# EAGLE schematic Maduino Zero 4G LTE v1.2 (EAGLE 6.1)
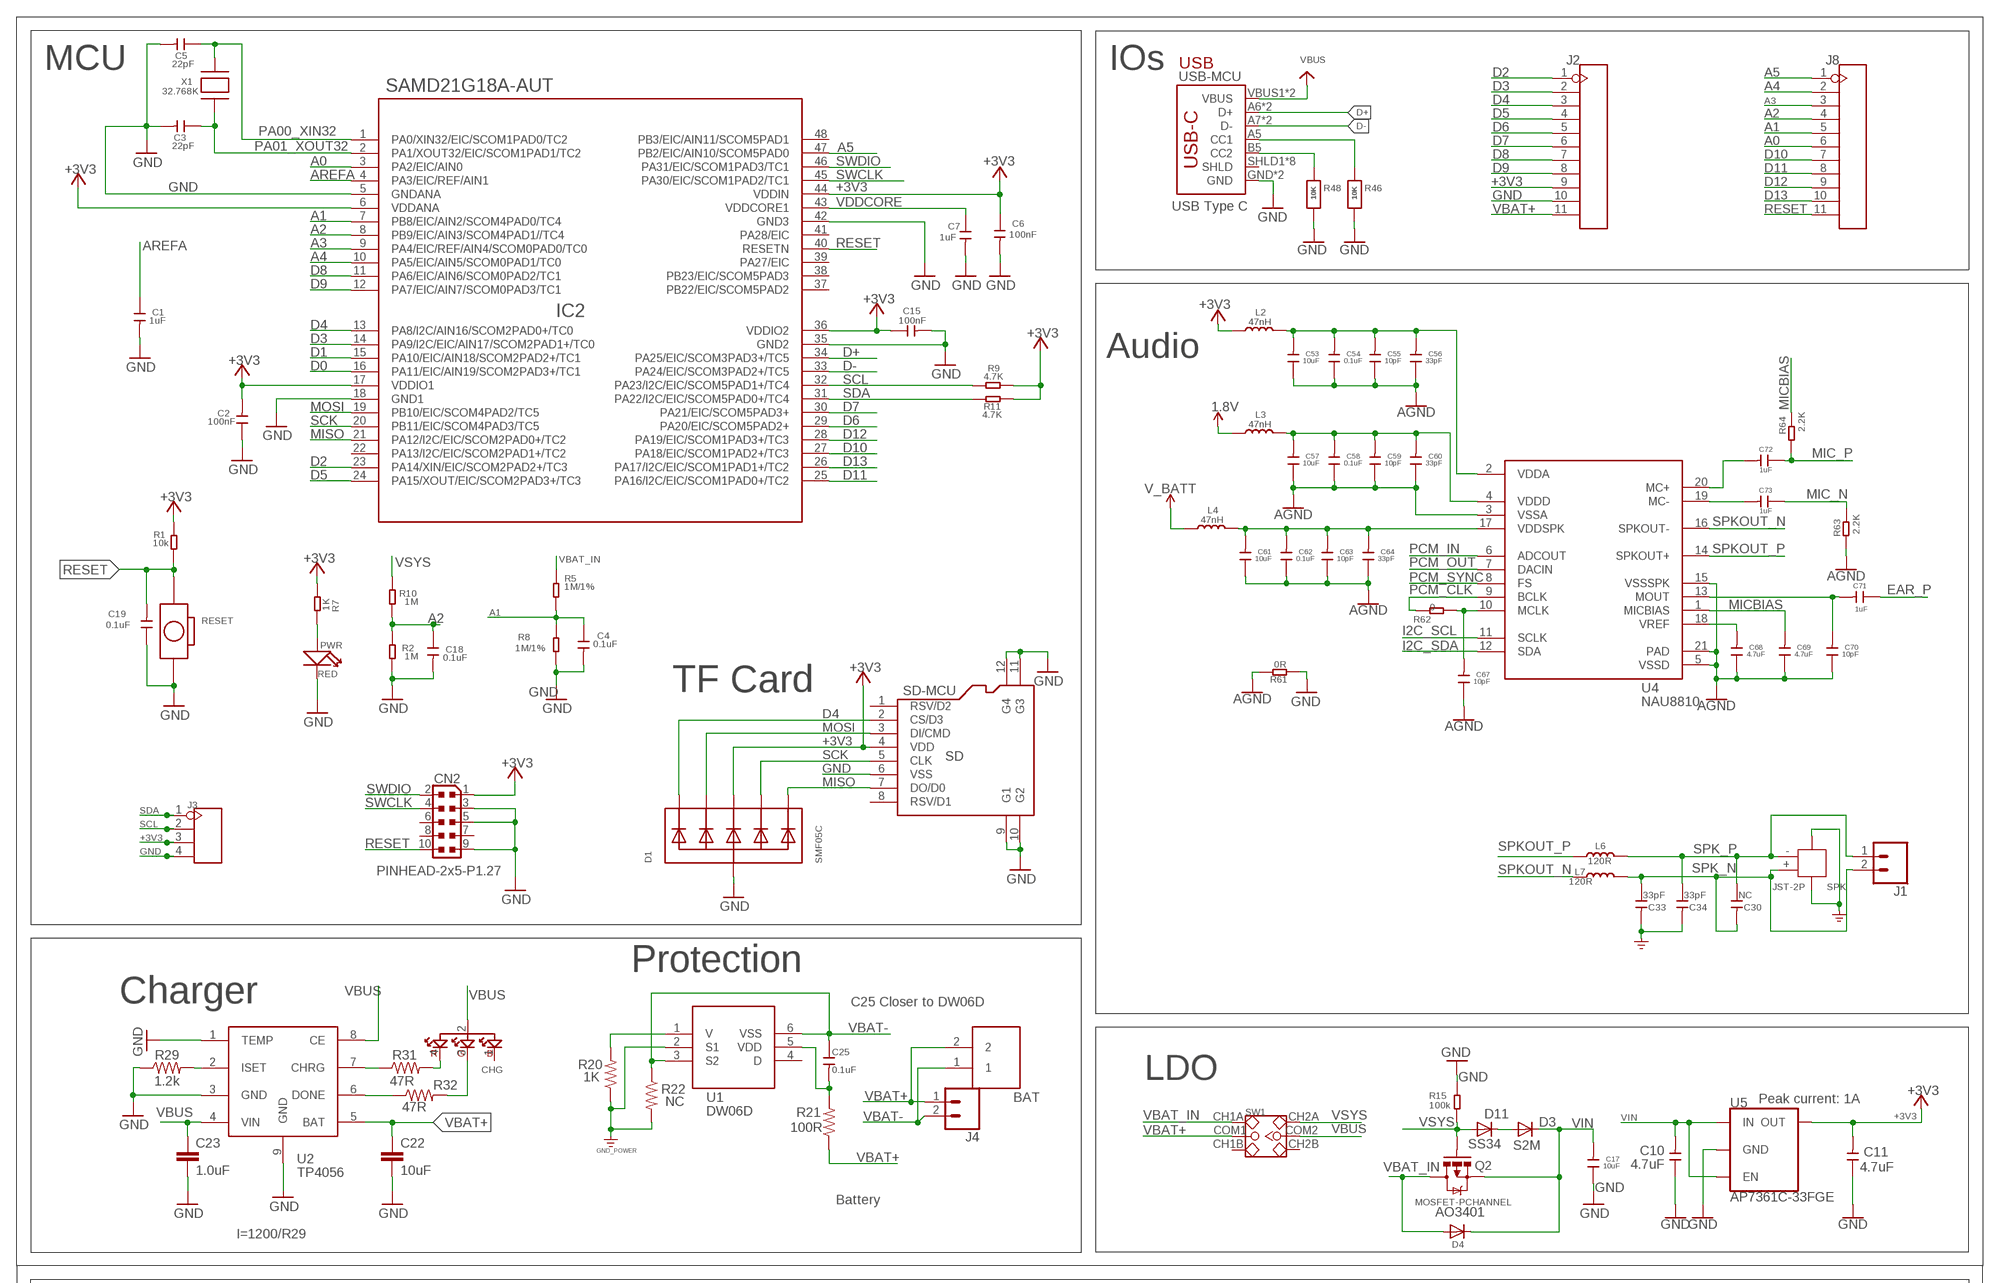
[diagram p0: schematic, sheet 1, part 1 of 2]
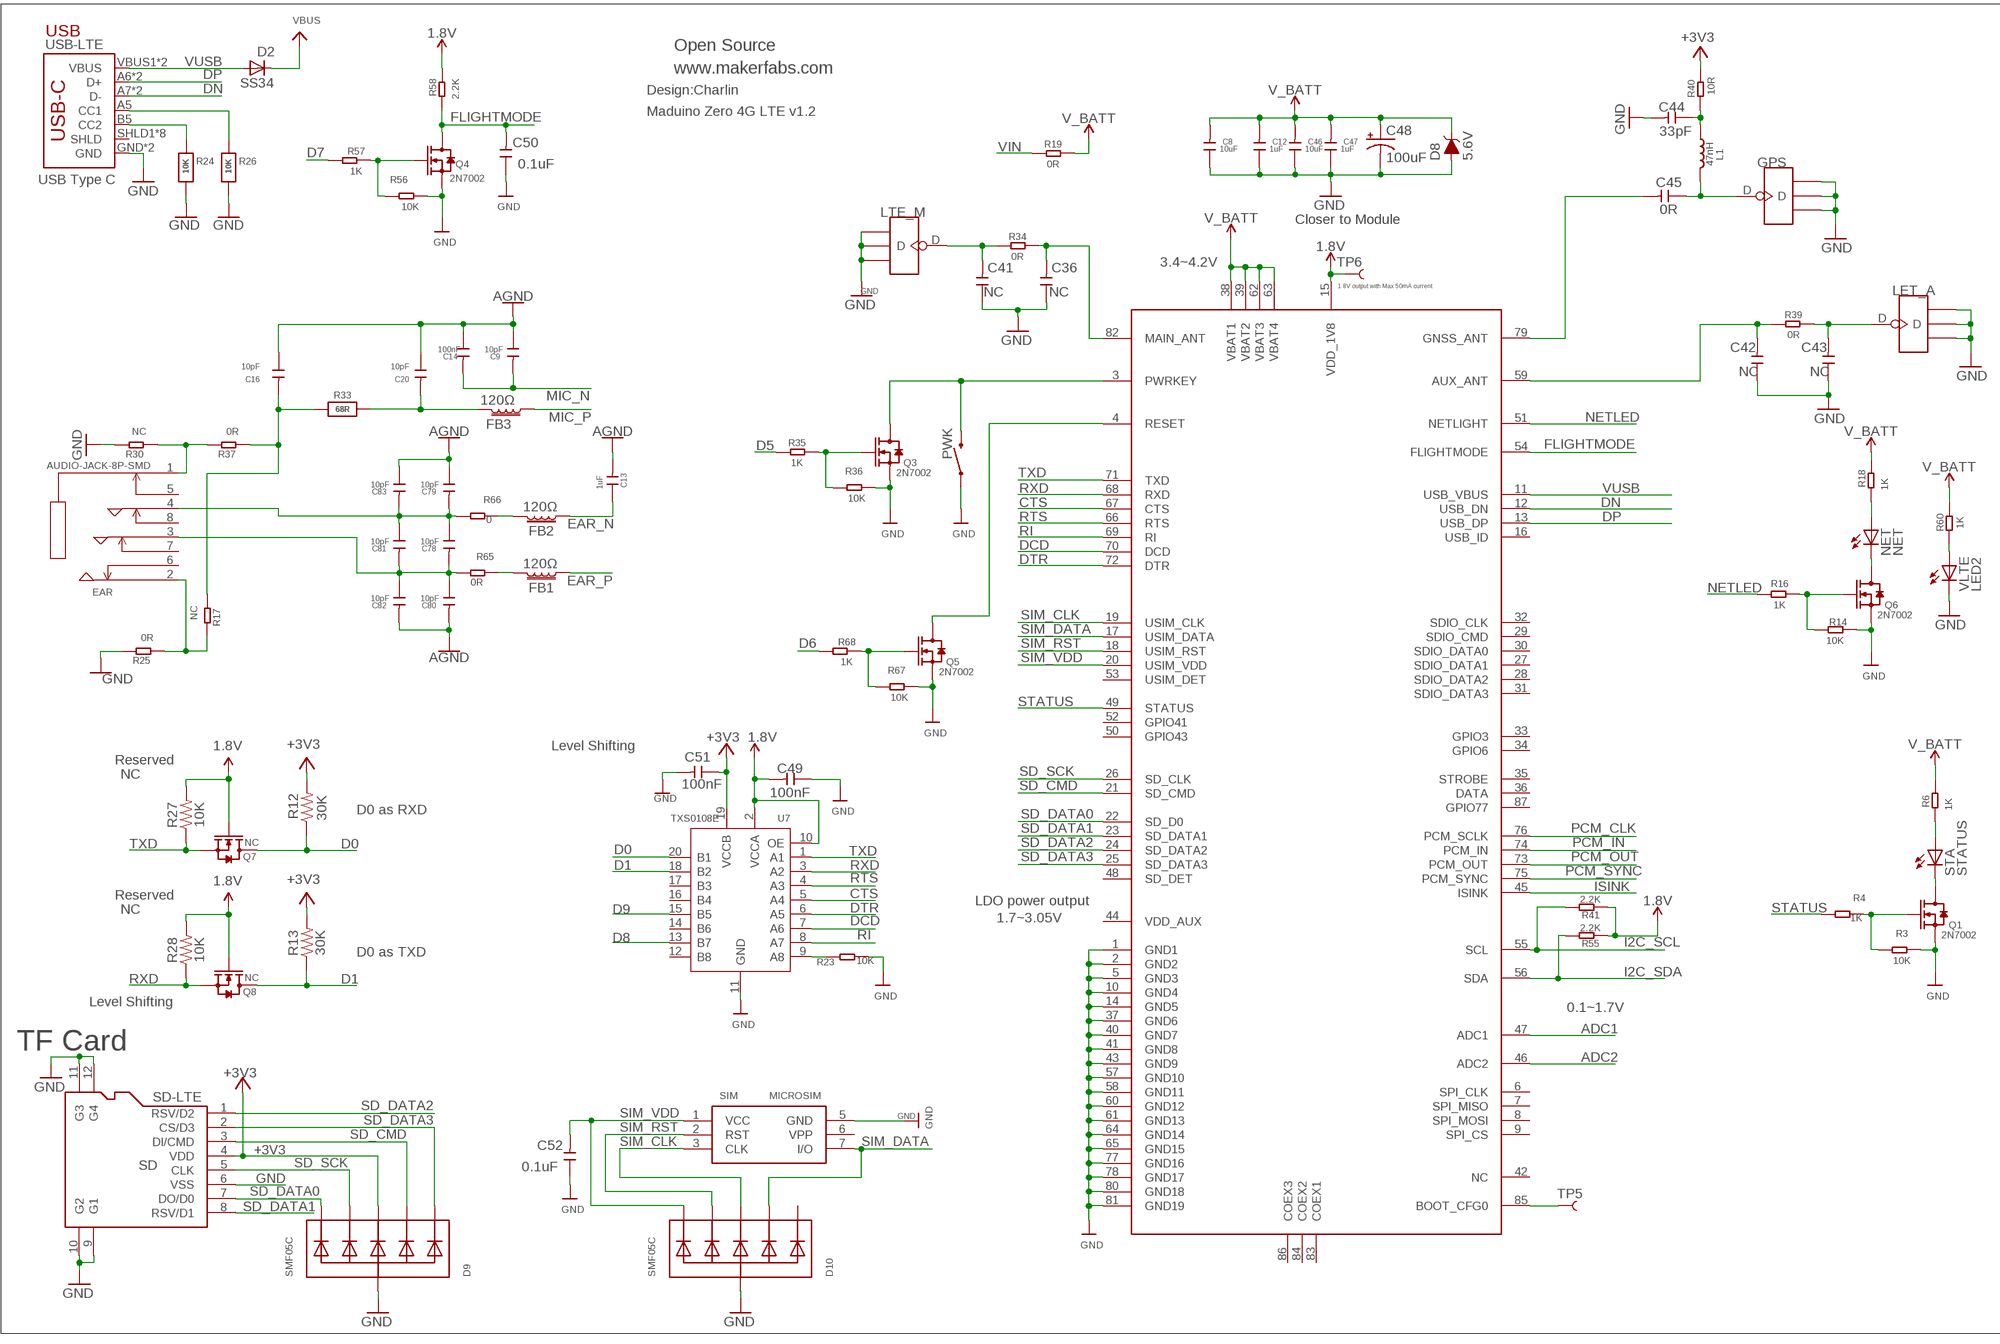
[diagram p1: schematic, sheet 1, part 2 of 2]

## Parts
BAT  PH2.0-2P-90-DIP  [PH2.0-2P-90-DIP]
C1  1uF  C-0603  [C0603]
C2  100nF  C-0603  [C0603]
C3  22pF  C-0603  [C0603]
C4  0.1uF  C-0603  [C0603]
C5  22pF  C-0603  [C0603]
C6  100nF  C-0603  [C0603]
C7  1uF  C-0603  [C0603]
C8  10uF  C-0603  [C0603]
C9  10pF  C-0603  [C0603]
C10  4.7uF  C-0603  [C0603]
C11  4.7uF  C-0603  [C0603]
C12  1uF  C-0603  [C0603]
C13  1uF  C-0603  [C0603]
C14  100nF  C-0603  [C0603]
C15  100nF  C-0603  [C0603]
C16  10pF  C-0603  [C0603]
C17  10uF  C-0603  [C0603]
C18  0.1uF  C-0603  [C0603]
C19  0.1uF  C-0603  [C0603]
C20  10pF  C-0603  [C0603]
C22  10uF  1.0UF-0603-16V-10%  [0603]
C23  1.0uF  1.0UF-0603-16V-10%  [0603]
C25  0.1uF  C-0603  [C0603]
C30  NC  CAP-0603  [C0603]
C33  33pF  CAP-0603  [C0603]
C34  33pF  CAP-0603  [C0603]
C36  NC  C-0603  [C0603]
C41  NC  C-0603  [C0603]
C42  NC  C-0603  [C0603]
C43  NC  C-0603  [C0603]
C44  33pF  C-0603  [C0603]
C45  0R  C-0603  [C0603]
C46  10uF  C-0603  [C0603]
C47  1uF  C-0603  [C0603]
C48  100uF  68UF-POLAR-EIA3528-10V-10%(TANT)  [EIA3528]
C49  100nF  C-0603  [C0603]
C50  0.1uF  C-0603  [C0603]
C51  100nF  C-0603  [C0603]
C52  0.1uF  C-0603  [C0603]
C53  10uF  C-0603  [C0603]
C54  0.1uF  C-0603  [C0603]
C55  10pF  C-0603  [C0603]
C56  33pF  C-0603  [C0603]
C57  10uF  C-0603  [C0603]
C58  0.1uF  C-0603  [C0603]
C59  10pF  C-0603  [C0603]
C60  33pF  C-0603  [C0603]
C61  10uF  C-0603  [C0603]
C62  0.1uF  C-0603  [C0603]
C63  10pF  C-0603  [C0603]
C64  33pF  C-0603  [C0603]
C67  10pF  C-0603  [C0603]
C68  4.7uF  C-0603  [C0603]
C69  4.7uF  C-0603  [C0603]
C70  10pF  C-0603  [C0603]
C71  1uF  C-0603  [C0603]
C72  1uF  C-0603  [C0603]
C73  1uF  C-0603  [C0603]
C78  10pF  C-0603  [C0603]
C79  10pF  C-0603  [C0603]
C80  10pF  C-0603  [C0603]
C81  10pF  C-0603  [C0603]
C82  10pF  C-0603  [C0603]
C83  10pF  C-0603  [C0603]
CHG  E6C0606RGBC3UDA  [SMD4-160L160W]
CN2  PINHEAD-2x5-P1.27  0171_PH127-205DF055G00AROUND-PADS  [PINHEAD_2X05_127]
D1  SMF05C  TVSARRAY_5LANE  [SOT363]
D2  SS34  DIODE-DO-214AC  [DO-214AC]
D3  S2M  DIODE-DO-214AC  [DO-214AC]
D4  DIODESOD-323F  [SOD-323F]
D8  5.6V  DIODE-ZENER-MMSZ5232BS  [SOD-323]
D9  SMF05C  TVSARRAY_5LANE  [SOT363]
D10  SMF05C  TVSARRAY_5LANE  [SOT363]
D11  SS34  DIODE-DO-214AC  [DO-214AC]
EAR  AUDIO-JACK-8P-SMD  AUDIO-JACK-8P-SMD'PJ-393'  [AUDIO8P-SMD-3.5-14.5X6.1X4.0MM]
FB1  120Ω  FERRITE_BEAD-0603  [0603]
FB2  120Ω  FERRITE_BEAD-0603  [0603]
FB3  120Ω  FERRITE_BEAD-0603  [0603]
GPS  ANTENNA-U-FL  [4P-U-FL]
IC2  SAMD21G18A-AUT  ATSAMD21G18A-AUT  [TQFP48-7X7]
J1  CONN_02LOCK  [1X02_LOCK]
J2  HEADER-11P-2.54  [11P-2.54]
J3  HEADER-4P-60/35MILROUND  [4P-65/35ROUND]
J4  CONN_02LOCK  [1X02_LOCK]
J8  HEADER-11P-2.54  [11P-2.54]
L1  47nH  L'0603'  [L0603]
L2  47nH  L'0603'  [L0603]
L3  47nH  L'0603'  [L0603]
L4  47nH  L'0603'  [L0603]
L6  120R  INDUCTOR/FERRITE-BEAD'0603'  [L0603]
L7  120R  INDUCTOR/FERRITE-BEAD'0603'  [L0603]
LET_A  ANTENNA-U-FL  [4P-U-FL]
LTE_M  ANTENNA-U-FL  [4P-U-FL]
NET  NET  LEDCHIP-LED0805  [CHIP-LED0805]
PWK  MOMENTARY-SWITCH-SPST-SMD-6.0X3.5MM  [TACTILE_SWITCH_SMD_6.0X3.5MM]
PWR  RED  LED'0603'  [LED-0603]
Q1  2N7002  MOSFET-N'SOT23'  [SOT23]
Q2  MOSFET-PCHANNEL  [SOT23-3]
Q3  2N7002  MOSFET-N'SOT23'  [SOT23]
Q4  2N7002  MOSFET-N'SOT23'  [SOT23]
Q5  2N7002  MOSFET-N'SOT23'  [SOT23]
Q6  2N7002  MOSFET-N'SOT23'  [SOT23]
Q7  NC  MOSFET-N'SOT23'  [SOT23]
Q8  NC  MOSFET-N'SOT23'  [SOT23]
R1  10k  R-0603  [R0603]
R2  1M  R-0603  [R0603]
R3  10K  R-0603  [R0603]
R4  1K  R-0603  [R0603]
R5  1M/1%  R-0603  [R0603]
R6  1K  R-0603  [R0603]
R7  1K  R-0603  [R0603]
R8  1M/1%  R-0603  [R0603]
R9  4.7K  R-0603  [R0603]
R10  1M  R-0603  [R0603]
R11  4.7K  R-0603  [R0603]
R12  30K  300KOHM-0603-1/10W-1%  [0603]
R13  30K  300KOHM-0603-1/10W-1%  [0603]
R14  10K  R-0603  [R0603]
R15  100k  R-0603  [R0603]
R16  1K  R-0603  [R0603]
R17  NC  R-0603  [R0603]
R18  1K  R-0603  [R0603]
R19  0R  R-0603  [R0603]
R20  1K  10KOHM-0603-1/10W-1%  [0603]
R21  100R  10KOHM-0603-1/10W-1%  [0603]
R22  NC  10KOHM-0603-1/10W-1%  [0603]
R23  10K  R-0603  [R0603]
R24  10K  RESISTOR_0603_NOOUT  [0603-NO]
R25  0R  R-0603  [R0603]
R26  10K  RESISTOR_0603_NOOUT  [0603-NO]
R27  10K  300KOHM-0603-1/10W-1%  [0603]
R28  10K  300KOHM-0603-1/10W-1%  [0603]
R29  1.2k  2.49KOHM-0603-1/10W-1%  [0603]
R30  NC  R-0603  [R0603]
R31  47R  330OHM-0603-1/10W-1%  [0603]
R32  47R  330OHM-0603-1/10W-1%  [0603]
R33  68R  RESISTOR_0603_NOOUT  [0603-NO]
R34  0R  R-0603  [R0603]
R35  1K  R-0603  [R0603]
R36  10K  R-0603  [R0603]
R37  0R  R-0603  [R0603]
R39  0R  R-0603  [R0603]
R40  10R  R-0603  [R0603]
R41  2.2K  R-0603  [R0603]
R46  10K  RESISTOR_0603_NOOUT  [0603-NO]
R48  10K  RESISTOR_0603_NOOUT  [0603-NO]
R55  2.2K  R-0603  [R0603]
R56  10K  R-0603  [R0603]
R57  1K  R-0603  [R0603]
R58  2.2K  R-0603  [R0603]
R60  1K  R-0603  [R0603]
R61  0R  R-0603  [R0603]
R62  0  R-0603  [R0603]
R63  2.2K  R-0603  [R0603]
R64  2.2K  R-0603  [R0603]
R65  0R  R-0603  [R0603]
R66  0  R-0603  [R0603]
R67  10K  R-0603  [R0603]
R68  1K  R-0603  [R0603]
RESET  BOTTON-2P-90D  [2P-7.62X3.56-90D]
SD-LTE  SD  HOLDER-MICROSD-8P  [8P-SMD]
SD-MCU  SD  HOLDER-MICROSD-8P  [8P-SMD]
SIM  MICROSIM  [MICROSIM]
SPK  JST-2P  JST-2P-SMD'2.0'  [HW2-SMD-2.0-90D]
STA  STATUS  LEDCHIP-LED0805  [CHIP-LED0805]
SW1  SWITCH-2CH-6P  [6P-2CH-2.54-7.6X3.0]
TP5  TEST-POINT3  [PAD.03X.03]
TP6  TEST-POINT3  [PAD.03X.03]
U1  DW06D  [SOT-23-6]
U2  TP4056  [SOP8-1.27P]
U4  NAU8810  [QFN21-50P-400L400W]
U5  AP7361C-33FGE  [8-UDFN]
U6  SIM7600  [SMD87-100P-3000L300W]
U7  TXS0108E  LOGIC-TXS0108EPWR  [TSSOP20-0.65-6.5X4.4MM]
USB-LTE  USB_C5  [USB-C-16P-5]
USB-MCU  USB_C5  [USB-C-16P-5]
VLTE  LED2  LEDCHIP-LED0805  [CHIP-LED0805]
X1  32.768K  XTAL-3.2X1.5  [XTAL3215]

## Nets
1.8V: C49.2 L3.1 Q7.1(G) Q8.1(G) R27.2 R28.2 R41.1 R55.1 R58.2 TP6.P$1 U6.15(VDD_1V8) U7.2(VCCA) U7.10(OE)
+3V3: C2.2 C6.1 C11.2 C15.1 C51.1 CN2.1 D1.4(C3) D9.4(C3) IC2.6(VDDANA) IC2.17(VDDIO1) IC2.36(VDDIO2) IC2.44(VDDIN) J2.9 J3.3 L2.1 R1.2 R7.1 R9.2 R11.2 R12.2 R13.2 R40.2 SD-LTE.4(VDD) SD-MCU.4(VDD) U5.1(OUT) U7.19(VCCB)
A0: IC2.3(PA2/EIC/AIN0) J8.6
A1: C4.1 IC2.7(PB8/EIC/AIN2/SCOM4PAD0/TC4) J8.5 R5.1 R8.2
A2: C18.1 IC2.8(PB9/EIC/AIN3/SCOM4PAD1//TC4) J8.4 R2.2 R10.1
A3: IC2.9(PA4/EIC/REF/AIN4/SCOM0PAD0/TC0) J8.3
A4: IC2.10(PA5/EIC/AIN5/SCOM0PAD1/TC0) J8.2
A5: IC2.47(PB2/EIC/AIN10/SCOM5PAD0) J8.1
ADC1: U6.47(ADC1)
ADC2: U6.46(ADC2)
AGND: C9.1 C13.2 C14.1 C16.1 C20.1 C53.1 C54.1 C55.1 C56.1 C57.1 C58.1 C59.1 C60.1 C61.1 C62.1 C63.1 C64.1 C67.1 C68.1 C69.1 C70.1 C79.1 C80.2 C82.2 C83.1 R61.2 R63.1 U4.3(VSSA) U4.5(VSSD) U4.15(VSSSPK) U4.21(PAD)
AREFA: C1.1 IC2.4(PA3/EIC/REF/AIN1)
CTS: U6.67(CTS) U7.5(A4)
D0: IC2.16(PA11/EIC/AIN19/SCOM2PAD3+/TC1) Q7.3(D) R12.1 U7.20(B1)
D1: IC2.15(PA10/EIC/AIN18/SCOM2PAD2+/TC1) Q8.3(D) R13.1 U7.18(B2)
D2: IC2.23(PA14/XIN/EIC/SCOM2PAD2+/TC3) J2.1
D3: IC2.14(PA9/I2C/EIC/AIN17/SCOM2PAD1+/TC0) J2.2
D4: D1.1(C1) IC2.13(PA8/I2C/AIN16/SCOM2PAD0+/TC0) J2.3 SD-MCU.2(CS/D3)
D5: IC2.24(PA15/XOUT/EIC/SCOM2PAD3+/TC3) J2.4 R35.2
D6: IC2.29(PA20/EIC/SCOM5PAD2+) J2.5 R68.2
D7: IC2.30(PA21/EIC/SCOM5PAD3+) J2.6 R57.2
D8: IC2.11(PA6/EIC/AIN6/SCOM0PAD2/TC1) J2.7 U7.13(B7)
D9: IC2.12(PA7/EIC/AIN7/SCOM0PAD3/TC1) J2.8 U7.15(B5)
D10: IC2.27(PA18/EIC/SCOM1PAD2+/TC3) J8.7
D11: IC2.25(PA16/I2C/EIC/SCOM1PAD0+/TC2) J8.8
D12: IC2.28(PA19/EIC/SCOM1PAD3+/TC3) J8.9
D13: IC2.26(PA17/I2C/EIC/SCOM1PAD1+/TC2) J8.10
D+: IC2.34(PA25/EIC/SCOM3PAD3+/TC5) USB-MCU.A6(D+) USB-MCU.B6(D+)
D-: IC2.33(PA24/EIC/SCOM3PAD2+/TC5) USB-MCU.A7(D-) USB-MCU.B7(D-)
DCD: U6.70(DCD) U7.7(A6)
DN: U6.12(USB_DN) USB-LTE.A7(D-) USB-LTE.B7(D-)
DONE: R32.1 U2.6(DONE)
DP: U6.13(USB_DP) USB-LTE.A6(D+) USB-LTE.B6(D+)
DTR: U6.72(DTR) U7.6(A5)
EAR_N: C13.1 FB2.1
EAR_P: C71.1 FB1.1
FLIGHTMODE: C50.2 Q4.3(D) R58.1 U6.54(FLIGHTMODE)
GND: C1.2 C2.1 C3.2 C4.2 C5.2 C6.2 C7.2 C8.1 C10.1 C11.1 C12.1 C15.2 C17.1 C18.2 C19.1 C22.2 C23.2 C33.2 C34.2 C36.1 C41.1 C42.1 C43.1 C44.2 C46.1 C47.1 C48.C(-) C49.1 C50.1 C51.2 C52.1 CN2.3 CN2.5 CN2.9 D1.2(A) D8.A D9.2(A) D10.2(A) GPS.GND1 GPS.GND2 GPS.GND3 IC2.5(GNDANA) IC2.18(GND1) IC2.35(GND2) IC2.42(GND3) J2.10 J3.4 LET_A.GND1 LET_A.GND2 LET_A.GND3 LTE_M.GND1 LTE_M.GND2 LTE_M.GND3 PWK.1 PWR.- Q1.2(S) Q3.2(S) Q4.2(S) Q5.2(S) Q6.2(S) R2.1 R3.1 R8.1 R14.1 R15.2 R20.1 R22.2 R23.1 R24.2 R25.2 R26.2 R29.1 R30.2 R36.1 R46.2 R48.2 R56.1 R61.1 R67.1 RESET.P$2 SD-LTE.6(VSS) SD-LTE.9(G1) SD-LTE.10(G2) SD-LTE.11(G3) SD-LTE.12(G4) SD-MCU.6(VSS) SD-MCU.9(G1) SD-MCU.10(G2) SD-MCU.11(G3) SD-MCU.12(G4) SIM.5(GND) SPK.3 SPK.4 U1.2(S1) U2.1(TEMP) U2.3(GND) U2.9(GND) U5.4(GND) U5.EP(GND) U6.1(GND1) U6.2(GND2) U6.5(GND3) U6.10(GND4) U6.14(GND5) U6.37(GND6) U6.40(GND7) U6.41(GND8) U6.43(GND9) U6.57(GND10) U6.58(GND11) U6.60(GND12) U6.61(GND13) U6.64(GND14) U6.65(GND15) U6.77(GND16) U6.78(GND17) U6.80(GND18) U6.81(GND19) U7.11(GND) USB-LTE.GND USB-LTE.GND2(GND) USB-MCU.GND USB-MCU.GND2(GND) VLTE.C ; supply symbol labelled GND_POWER
I2C_SCL: R41.2 U4.11(SCLK) U6.55(SCL)
I2C_SDA: R55.2 U4.12(SDA) U6.56(SDA)
ISET: R29.2 U2.2(ISET)
ISINK: U6.45(ISINK)
MIC_N: C9.2 C14.2 C73.1 R63.2
MIC_P: C72.1 FB3.1 R64.1
MICBIAS: C69.2 R64.2 U4.1(MICBIAS)
MISO: D1.6(C5) IC2.21(PA12/I2C/EIC/SCOM2PAD0+/TC2) SD-MCU.7(DO/D0)
MOSI: D1.3(C2) IC2.19(PB10/EIC/SCOM4PAD2/TC5) SD-MCU.3(DI/CMD)
N$1: Q1.1(G) R3.2 R4.1
N$2: R6.1 STA.A
N$3: PWR.+ R7.2
N$4: Q1.3(D) STA.C
N$5: Q6.1(G) R14.2 R16.1
N$6: NET.A R18.1
N$7: NET.C Q6.3(D)
N$8: TP5.P$1 U6.85(BOOT_CFG0)
N$9: C25.2 R21.2 U1.5(VDD)
N$10: R20.2 U1.1(V)
N$11: CHG.3 R32.2
N$12: R31.1 U2.7(CHRG)
N$13: D3.A D11.C
N$14: C16.2 R17.1 R33.1 R37.1
N$15: C20.2 FB3.2 R33.2
N$16: EAR.2 R17.2 R25.1
N$17: R26.1 USB-LTE.A5(CC1)
N$18: CHG.4 R31.2
N$19: R24.1 USB-LTE.B5(CC2)
N$20: EAR.1 R30.1 R37.2
N$21: C78.1 C79.2 C81.1 C83.2 EAR.4 R66.1
N$24: R23.2 U7.9(A8)
N$25: R46.1 USB-MCU.A5(CC1)
N$26: R48.1 USB-MCU.B5(CC2)
N$40: C36.2 R34.1 U6.82(MAIN_ANT)
N$41: C41.2 LTE_M.D R34.2
N$42: PWK.2 Q3.3(D) U6.3(PWRKEY)
N$43: Q3.1(G) R35.1 R36.2
N$46: R60.1 VLTE.A
N$48: C53.2 C54.2 C55.2 C56.2 L2.2 U4.2(VDDA)
N$49: C70.2 C71.2 U4.13(MOUT)
N$50: C61.2 C62.2 C63.2 C64.2 L4.2 U4.17(VDDSPK)
N$51: C68.2 U4.18(VREF)
N$52: C57.2 C58.2 C59.2 C60.2 L3.2 U4.4(VDDD)
N$54: C73.2 U4.19(MC-)
N$57: C67.2 R62.1 U4.10(MCLK)
N$58: C72.2 U4.20(MC+)
N$59: FB1.2 R65.2
N$63: FB2.2 R66.2
N$64: C78.2 C80.1 C81.2 C82.1 EAR.3 R65.1
N$69: Q5.3(D) U6.4(RESET)
N$70: Q5.1(G) R67.2 R68.1
N$72: C43.2 LET_A.D R39.2
N$73: C44.1 L1.1 R40.1
N$74: C42.2 R39.1 U6.59(AUX_ANT)
N$75: C45.2 U6.79(GNSS_ANT)
N$76: C45.1 GPS.D L1.2
N$94: Q4.1(G) R56.2 R57.1
NETLED: R16.2 U6.51(NETLIGHT)
PA00_XIN32: C5.1 IC2.1(PA0/XIN32/EIC/SCOM1PAD0/TC2) X1.P$2
PA01_XOUT32: C3.1 IC2.2(PA1/XOUT32/EIC/SCOM1PAD1/TC2) X1.P$1
PCM_CLK: R62.2 U4.9(BCLK) U6.76(PCM_SCLK)
PCM_IN: U4.6(ADCOUT) U6.74(PCM_IN)
PCM_OUT: U4.7(DACIN) U6.73(PCM_OUT)
PCM_SYNC: U4.8(FS) U6.75(PCM_SYNC)
RESET: C19.2 CN2.10 IC2.40(RESETN) J8.11 R1.1 RESET.P$1
RI: U6.69(RI) U7.8(A7)
RTS: U6.66(RTS) U7.4(A3)
RXD: Q8.2(S) R28.1 U6.68(RXD) U7.3(A2)
SCK: D1.5(C4) IC2.20(PB11/EIC/SCOM4PAD3/TC5) SD-MCU.5(CLK)
SCL: IC2.32(PA23/I2C/EIC/SCOM5PAD1+/TC4) J3.2 R9.1
SD_CMD: D9.3(C2) SD-LTE.3(DI/CMD) U6.21(SD_CMD)
SD_DATA0: D9.6(C5) SD-LTE.7(DO/D0) U6.22(SD_D0)
SD_DATA1: SD-LTE.8(RSV/D1) U6.23(SD_DATA1)
SD_DATA2: SD-LTE.1(RSV/D2) U6.24(SD_DATA2)
SD_DATA3: D9.1(C1) SD-LTE.2(CS/D3) U6.25(SD_DATA3)
SD_SCK: D9.5(C4) SD-LTE.5(CLK) U6.26(SD_CLK)
SDA: IC2.31(PA22/I2C/EIC/SCOM5PAD0+/TC4) J3.1 R11.1
SIM_CLK: D10.4(C3) SIM.3(CLK) U6.19(USIM_CLK)
SIM_DATA: D10.3(C2) SIM.7(I/O) U6.17(USIM_DATA)
SIM_RST: D10.5(C4) SIM.2(RST) U6.18(USIM_RST)
SIM_VDD: C52.2 D10.6(C5) SIM.1(VCC) U6.20(USIM_VDD)
SPK_N: C30.2 C33.1 J1.2 L7.2 SPK.+
SPK_P: C30.1 C34.1 J1.1 L6.2 SPK.-
SPKOUT_N: L7.1 U4.16(SPKOUT-)
SPKOUT_P: L6.1 U4.14(SPKOUT+)
STATUS: R4.2 U6.49(STATUS)
SWCLK: CN2.4 IC2.45(PA30/EIC/SCOM1PAD2/TC1)
SWDIO: CN2.2 IC2.46(PA31/EIC/SCOM1PAD3/TC1)
TXD: Q7.2(S) R27.1 U6.71(TXD) U7.1(A1)
V_BATT: C8.2 C12.2 C46.2 C47.2 C48.A(+) D8.C L4.1 R6.2 R18.2 R19.1 R60.2 U6.38(VBAT1) U6.39(VBAT2) U6.62(VBAT3) U6.63(VBAT4)
VBAT+: BAT.2 C22.1 J2.11 J4.1 R21.1 SW1.COM1 U2.5(BAT)
VBAT-: BAT.1 C25.1 J4.2 R22.1 U1.3(S2) U1.6(VSS)
VBAT_IN: D4.A Q2.3(D) R5.2 SW1.CH1A
VBUS: C23.1 CHG.2 D2.C SW1.COM2 U2.4(VIN) U2.8(CE) USB-MCU.VBUS1(VBUS) USB-MCU.VBUS2(VBUS)
VDDCORE: C7.1 IC2.43(VDDCORE1)
VIN: C10.2 C17.2 D3.C D4.C Q2.2(S) R19.2 U5.5(EN) U5.8(IN)
VSYS: D11.A Q2.1(G) R10.2 R15.1 SW1.CH2A
VUSB: D2.A U6.11(USB_VBUS) USB-LTE.VBUS1(VBUS) USB-LTE.VBUS2(VBUS)
Unconnected: CHG.1 CN2.6 CN2.7 CN2.8 D10.1(C1) EAR.5 EAR.6 EAR.7 EAR.8 IC2.22(PA13/I2C/EIC/SCOM2PAD1+/TC2) IC2.37(PB22/EIC/SCOM5PAD2) IC2.38(PB23/EIC/SCOM5PAD3) IC2.39(PA27/EIC) IC2.41(PA28/EIC) IC2.48(PB3/EIC/AIN11/SCOM5PAD1) SD-MCU.1(RSV/D2) SD-MCU.8(RSV/D1) SIM.6(VPP) SW1.CH1B SW1.CH2B U1.4(D) U6.6(SPI_CLK) U6.7(SPI_MISO) U6.8(SPI_MOSI) U6.9(SPI_CS) U6.16(USB_ID) U6.27(SDIO_DATA1) U6.28(SDIO_DATA2) U6.29(SDIO_CMD) U6.30(SDIO_DATA0) U6.31(SDIO_DATA3) U6.32(SDIO_CLK) U6.33(GPIO3) U6.34(GPIO6) U6.35(STROBE) U6.36(DATA) U6.42(NC) U6.44(VDD_AUX) U6.48(SD_DET) U6.50(GPIO43) U6.52(GPIO41) U6.53(USIM_DET) U6.83(COEX1) U6.84(COEX2) U6.86(COEX3) U6.87(GPIO77) U7.12(B8) U7.14(B6) U7.16(B4) U7.17(B3) USB-LTE.SHLD1(SHLD) USB-LTE.SHLD2(SHLD) USB-LTE.SHLD3(SHLD) USB-LTE.SHLD4(SHLD) USB-LTE.SHLD5(SHLD) USB-LTE.SHLD6(SHLD) USB-LTE.SHLD7(SHLD) USB-LTE.SHLD8(SHLD) USB-MCU.SHLD1(SHLD) USB-MCU.SHLD2(SHLD) USB-MCU.SHLD3(SHLD) USB-MCU.SHLD4(SHLD) USB-MCU.SHLD5(SHLD) USB-MCU.SHLD6(SHLD) USB-MCU.SHLD7(SHLD) USB-MCU.SHLD8(SHLD)

## Notes on the sheet
- MCU | IOs | USB
- USB Type C
- Audio
- TF Card
- Protection
- Charger | C25 Closer to DW06D
- LDO
- BAT | Peak current: 1A
- Battery
- AO3401
- I=1200/R29
- USB
- Open Source
- www.makerfabs.com
- Design:Charlin
- Maduino Zero 4G LTE v1.2
- USB Type C
- Closer to Module
- 3.4~4.2V
- 1.8V output with Max 50mA current
- Level Shifting
- Reserved
- NC
- D0 as RXD
- Reserved
- LDO power output
- NC
- 1.7~3.05V
- D0 as TXD
- Level Shifting
- 0.1~1.7V
- TF Card

## Library data of the parts
BAT = Connector:PH2.0-2P-90-DIP
C1-C20 C25 C36 C41-C47 C49-C64 C67-C73 C78-C83 = Discrete:C*: Ceramic Capacitors
C22 = SparkFun-Capacitors:1.0UF: 1µF ceramic capacitors A capacitor is a passive two-terminal electrical component used to store electrical energy temporarily in an electric field.; PROD_ID: CAP-00868; VALUE: 1.0uF
C23 = SparkFun-Capacitors:1.0UF: 1µF ceramic capacitors A capacitor is a passive two-terminal electrical component used to store electrical energy temporarily in an electric field.; PROD_ID: CAP-00868
C30 C33 C34 = Discrete-new:CAP: Ceramic Capacitors
C48 = SparkFun-Capacitors:68UF-POLAR: 68µF polarized capacitors A capacitor is a passive two-terminal electrical component used to store electrical energy temporarily in an electric field.; PROD_ID: CAP-10790; VALUE: 68uF
CHG = self:E6C0606RGBC3UDA
CN2 = Connettori:0171_PH127-205DF055G00A: 2x5 PASSO 1,27
D1 D9 D10 = microbuilder:TVSARRAY_5LANE: Voltage Transient Suppressor Array SOT363 SMF05C - 100W 5V: Digikey - SMF05CT1GOSCT-ND
D2 D3 D11 = diode:DIODE-: DIODE
D4 = adafruit2:DIODE: Diode SMADIODE - SMA Surface Mount Package 20V 1A Schottky Diode Digikey: 641-1014-6-ND DO-1N4148 - Through Hole Small Current Diode SOD-123 20V 1 A (.5mV Vf) Schottky Diode - Digikey: MBRX120TPMSCT-ND SOD-323 10V 570mA (.38mV Vf, 3ns) Schottky Diode - Digikey: ZLLS410CT-ND SOD-523 30V 30mA Schottky Diode (RB751S-40TE61) - Digikey: RB751S-40TE61CT-ND SOT23-R/W - SOT23 Package (R = Solder Paste/Reflow Ovens, W = Hand-Soldering) BAT54Film 40V 300mA - Digikey: 497-7162-1-ND
D8 = SparkFun-DiscreteSemi:DIODE-ZENER: Zener Diode A Zener diode allows current to flow from its anode to its cathode like a normal semiconductor diode, but it also permits current to flow in the reverse direction when its "Zener voltage" is reached. - WIkipedia; PROD_ID: DIO-12442
EAR = Connector-new:AUDIO-JACK-8P-SMD: 320040009
FB1-FB3 = SparkFun-Coils:FERRITE_BEAD: Ferrite Bead (blocks, cores, rings, chokes, etc.) Inductor with layers of ferrite used to suppress high frequencies. Often used to isolate high frequency noise. SparkFun Products: IOIO-OTG - V2.2 <https://www.sparkfun.com/products/13613> SparkFun SAMD21 Mini Breakout <https://www.sparkfun.com/products/13664> SparkFun 6 Degrees of Freedom Breakout - LSM6DS3 <https://www.sparkfun.com/products/13339> SparkFun SAMD21 Dev Breakout <https://www.sparkfun.com/products/13672>; PROD_ID: NDUC-13805; VALUE: 30Ω/1.8A
GPS LET_A LTE_M = Connector:ANTENNA-U-FL
IC2 = IC:ATSAMD21G18A-AUT: Atmel D21 32bit ARM Cortex-M0 microcontroller - 48 PIN TQFP 256KB flash memory + 32KB SRAM
J1 J4 = SparkFun-Connectors:CONN_02: Multi connection point. Often used as Generic Header-pin footprint for 0.1 inch spaced/style header connections On any of the 0.1 inch spaced packages, you can populate with these: Break Away Headers - Straight <https://www.sparkfun.com/products/116> (PRT-00116) Break Away Male Headers - Right Angle <https://www.sparkfun.com/products/553> (PRT-00553) Female Headers <https://www.sparkfun.com/products/115> (PRT-00115) Break Away Headers - Machine Pin <https://www.sparkfun.com/products/117> (PRT-00117) Break Away Female Headers - Swiss Machine Pin <https://www.sparkfun.com/products/743> (PRT-00743) For SCREWTERMINALS and SPRING TERMINALS visit here: Screw Terimnals on SparkFun.com <https://www.sparkfun.com/search/results?term=Screw+Terminals> (5mm/3.5mm/2.54mm spacing) This device is also useful as a general connection point to wire up your design to another part of your project. Our various solder wires solder well into these plated through hole pads. Hook-Up Wire - Assortment (Stranded, 22 AWG) <https://www.sparkfun.com/products/11375> (PRT-11375) Hook-Up Wire - Assortment (Solid Core, 22 AWG) <https://www.sparkfun.com/products/11367> (PRT-11367) View the entire wire category on our website here <https://www.sparkfun.com/categories/141> Special notes: Molex polarized connector foot print use with: PRT-08233 with associated crimp pins and housings. 2.54_SCREWTERM for use with PRT-10571. 3.5mm Screw Terminal footprints for PRT-08084 5mm Screw Terminal footprints for use with PRT-08432
J2 J8 = Connector:HEADER-11P
J3 = Connector:HEADER-4P
L1-L4 = Discrete:L*
L6 L7 = Discrete-new:INDUCTOR/FERRITE-BEAD
NET STA VLTE = adafruit2:LED: LED OSRAM: - CHIPLED LG R971, LG N971, LY N971, LG Q971, LY Q971, LO R971, LY R971 LH N974, LH R974 LS Q976, LO Q976, LY Q976 LO Q996 - Hyper CHIPLED LW Q18S LB Q993, LB Q99A, LB R99A - SideLED LS A670, LO A670, LY A670, LG A670, LP A670 LB A673, LV A673, LT A673, LW A673 LH A674 LY A675 LS A676, LA A676, LO A676, LY A676, LW A676 LS A679, LY A679, LG A679 - Hyper Micro SIDELED® LS Y876, LA Y876, LO Y876, LY Y876 LT Y87S - SmartLED LW L88C, LW L88S LB L89C, LB L89S, LG L890 LS L89K, LO L89K, LY L89K LS L896, LA L896, LO L896, LY L896 - TOPLED LS T670, LO T670, LY T670, LG T670, LP T670 LSG T670, LSP T670, LSY T670, LOP T670, LYG T670 LG T671, LOG T671, LSG T671 LB T673, LV T673, LT T673, LW T673 LH T674 LS T676, LA T676, LO T676, LY T676, LB T676, LH T676, LSB T676, LW T676 LB T67C, LV T67C, LT T67C, LS T67K, LO T67K, LY T67K, LW E67C LS E67B, LA E67B, LO E67B, LY E67B, LB E67C, LV E67C, LT E67C LW T67C LS T679, LY T679, LG T679 LS T770, LO T770, LY T770, LG T770, LP T770 LB T773, LV T773, LT T773, LW T773 LH T774 LS E675, LA E675, LY E675, LS T675 LS T776, LA T776, LO T776, LY T776, LB T776 LHGB T686 LT T68C, LB T68C - Hyper Mini TOPLED® LB M676 - Mini TOPLED Santana® LG M470 LS M47K, LO M47K, LY M47K Source: http://www.osram.convergy.de/
PWK = SparkFun-Switches:MOMENTARY-SWITCH-SPST: Momentary Switch (Pushbutton) - SPST Normally-open (NO) SPST momentary switches (buttons, pushbuttons). Variants PTH-12MM - 12mm square, through-hole Momentary Pushbutton Switch - 12mm Square <https://www.sparkfun.com/products/9190> (COM-09190) PTH-6.0MM, PTH-6.0MM-KIT - 6.0mm square, through-hole Mini Pushbutton Switch <https://www.sparkfun.com/products/97> (COM-00097) KIT package intended for soldering kit's - only one side of pads' copper is exposed. PTH-RIGHT-ANGLE-KIT - Right-angle, through-hole Right Angle Tactile Button <https://www.sparkfun.com/products/10791> - Used on SparkFun BigTime Watch Kit <https://www.sparkfun.com/products/11734> SMD-12MM - 12mm square, surface-mount Tactile Button - SMD (12mm) <https://www.sparkfun.com/products/12993> (COM-12993) Used on SparkFun PicoBoard <https://www.sparkfun.com/products/11888> SMD-4.5MM - 4.5mm Square Trackball Switch Used on SparkFun Blackberry Trackballer Breakout <https://www.sparkfun.com/products/13169> SMD-4.6MMX2.8MM - 4.60mm x 2.80mm, surface mount Used on SparkFun SAMD21 Mini Breakout <https://www.sparkfun.com/products/13664> SMD-5.2MM, SMD-5.2-REDUNDANT - 5.2mm square, surface-mount Mini Pushbutton Switch - SMD <https://www.sparkfun.com/products/8720> (COM-08720) Used on Arduino Pro Mini <https://www.sparkfun.com/products/11114> REDUNDANT package connects both switch circuits together SMD-6.0X3.5MM - 6.0 x 3.5mm, surface mount Momentary Reset Switch SMD <https://www.sparkfun.com/products/8229> (COM-08229) SMD-6.2MM-TALL - 6.2mm square, surface mount Tactile Button - SMD (6mm) <https://www.sparkfun.com/products/12992> Used on SparkFun Digital Sandbox <https://www.sparkfun.com/products/12651> SMD-RIGHT-ANGLE - Right-angle, surface mount Used on SparkFun Block for Intel® Edison - Arduino <https://www.sparkfun.com/products/13036>; PROD_ID: SWCH-00815; SF_SKU: COM-08229
PWR = Discrete:LED*
Q1 Q3-Q8 = Discrete:MOSFET-N: IRLL014: http://www.vishay.com/docs/91319/sihll014.pdf
Q2 = User-Submitted:MOSFET-PCHANNEL: Generic PMOSFET IRLML2244 - TRANS-11153 (SOT-23 -20V -4.3A) (1.Gate 2.Source 3.Drain) FQP27P06 - COM-10349 <http://www.sparkfun.com/products/10349> (TO-220 -60V -27A) (1.Gate 2.Source 3.Drain); PROD_ID: TRANS-08285
R1-R11 R14-R19 R23 R25 R30 R34-R37 R39-R41 R55-R58 R60-R68 = Discrete:R*
R12 R13 R27 R28 = SparkFun-Resistors:300KOHM: 300kΩ resistor A resistor is a passive two-terminal electrical component that implements electrical resistance as a circuit element. Resistors act to reduce current flow, and, at the same time, act to lower voltage levels within circuits. - Wikipedia; PROD_ID: RES-10809; VALUE: 300k
R20-R22 = SparkFun-Resistors:10KOHM: 10kΩ resistor A resistor is a passive two-terminal electrical component that implements electrical resistance as a circuit element. Resistors act to reduce current flow, and, at the same time, act to lower voltage levels within circuits.; PROD_ID: RES-00824; VALUE: 10k
R24 R26 R33 R46 R48 = microbuilder:RESISTOR: Resistors For new designs, use the packages preceded by an '_' character since they are more reliable: The following footprints should be used on most boards: _0402 - Standard footprint for regular board layouts _0603 - Standard footprint for regular board layouts _0805 - Standard footprint for regular board layouts _1206 - Standard footprint for regular board layouts For extremely tight-pitch boards where space is at a premium, the following 'micro-pitch' footprints can be used (smaller pads, no silkscreen outline, etc.): _0402MP - Micro-pitch footprint for very dense/compact boards _0603MP - Micro-pitch footprint for very dense/compact boards _0805MP - Micro-pitch footprint for very dense/compact boards _1206MP - Micro-pitch footprint for very dense/compact boards
R29 = SparkFun-Resistors:2.49KOHM: 2.49kΩ resistor A resistor is a passive two-terminal electrical component that implements electrical resistance as a circuit element. Resistors act to reduce current flow, and, at the same time, act to lower voltage levels within circuits. - Wikipedia; PROD_ID: RES-09568; VALUE: 2.49k
R31 R32 = SparkFun-Resistors:330OHM: 330Ω resistor A resistor is a passive two-terminal electrical component that implements electrical resistance as a circuit element. Resistors act to reduce current flow, and, at the same time, act to lower voltage levels within circuits. - Wikipedia; PROD_ID: RES-00818; VALUE: 330
RESET = Discrete:BOTTON-2P
SD-LTE SD-MCU = Connector:HOLDER-MICROSD-8P
SIM = Connector:MICROSIM
SPK = Connector-new:JST-2P-SMD: 2P-SMD-1.0-90D:320110054;2P-SMD-2.0-90D:320110026
SW1 = Discrete:SWITCH-2CH-6P
TP5 TP6 = SparkFun-Connectors:TEST-POINT: SparkFun Test Points Bare copper test points for troubleshooting or In-Circuit-Testing. These are used by our Production team for verifying production board runs using pogo-pins on test beds. SparkFun Products: SparkFun LSM9DS1 Breakout <https://www.sparkfun.com/products/13284> SparkFun PSOC <https://www.sparkfun.com/products/13714> SparkFun Load Cell Amplifier <https://www.sparkfun.com/products/13879>
U1 = self:DW06D
U2 = self:TP4056
U4 = user01:NAU8810: NAU8810
U5 = ublox:AP7361C-33FGE: AP7361C 3.3V LDO Regulator; PROD_ID: VREG-14094
U6 = user01:SIM7600
U7 = IC-new:LOGIC-TXS0108EPWR: 310050026
USB-LTE USB-MCU = USBC:USB_C: USB Type C 16Pin Connector Super Speed pins not available on the 16-pin purely SMD connector so this part is best for USB 2.0 implementations. D1 and D2 are tied together enabling D+/- no matter which way the cable is plugged into the connector. The two channel configuration pins (CC1/2) are exposed. These are normally connected to ground via 5.1k resistors but can be reconfigured for high current/high power applications.
X1 = adafruit2:XTAL: Low cost SMT crystals, no capacitors included http://www.ladyada.net/library/eagle

## Net classes
2 gnd: width 0.305 mm, drill 0.559 mm, clearance 0.254 mm
3 usbvcc: width 0.508 mm, drill 0.61 mm, clearance 0.254 mm
4 USBpair: width 0.254 mm, drill 0.406 mm, clearance 0.406 mm